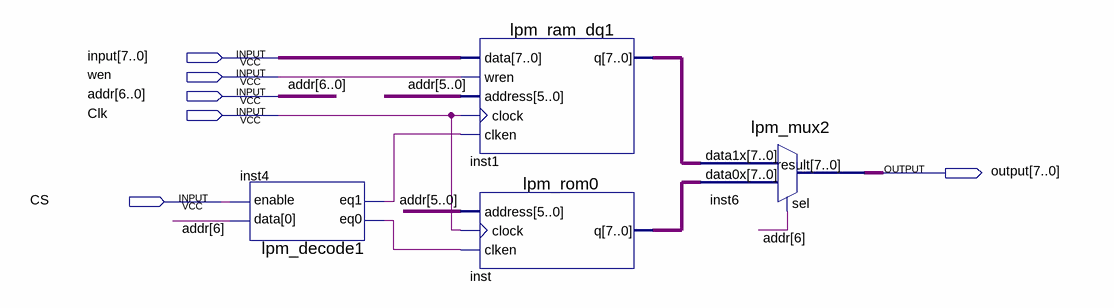
[diagram p0: schematic sheet]
// Quartus schematic Mem.bdf as structural Verilog: 4 symbols, 6 pins
module Mem (
  input  [7:0] \input ,
  input  wen,
  input  [6:0] addr,
  input  Clk,
  input  CS,
  output [7:0] \output 
);

  wire inst4_eq0, inst4_eq1;
  wire [7:0] inst1_q, inst_q;

  lpm_decode1 inst4 (.data(addr[6]), .enable(CS), .eq0(inst4_eq0), .eq1(inst4_eq1));
  lpm_ram_dq1 inst1 (.data(\input ), .wren(wen), .address(addr[5:0]), .clock(Clk), .clken(inst4_eq1), .q(inst1_q));
  lpm_rom0 inst (.address(addr[5:0]), .clock(Clk), .clken(inst4_eq0), .q(inst_q));
  lpm_mux2 inst6 (.data1x(inst1_q), .data0x(inst_q), .sel(addr[6]), .result(\output ));
endmodule
